# Altium project Vapeix_mini.PrjPcb
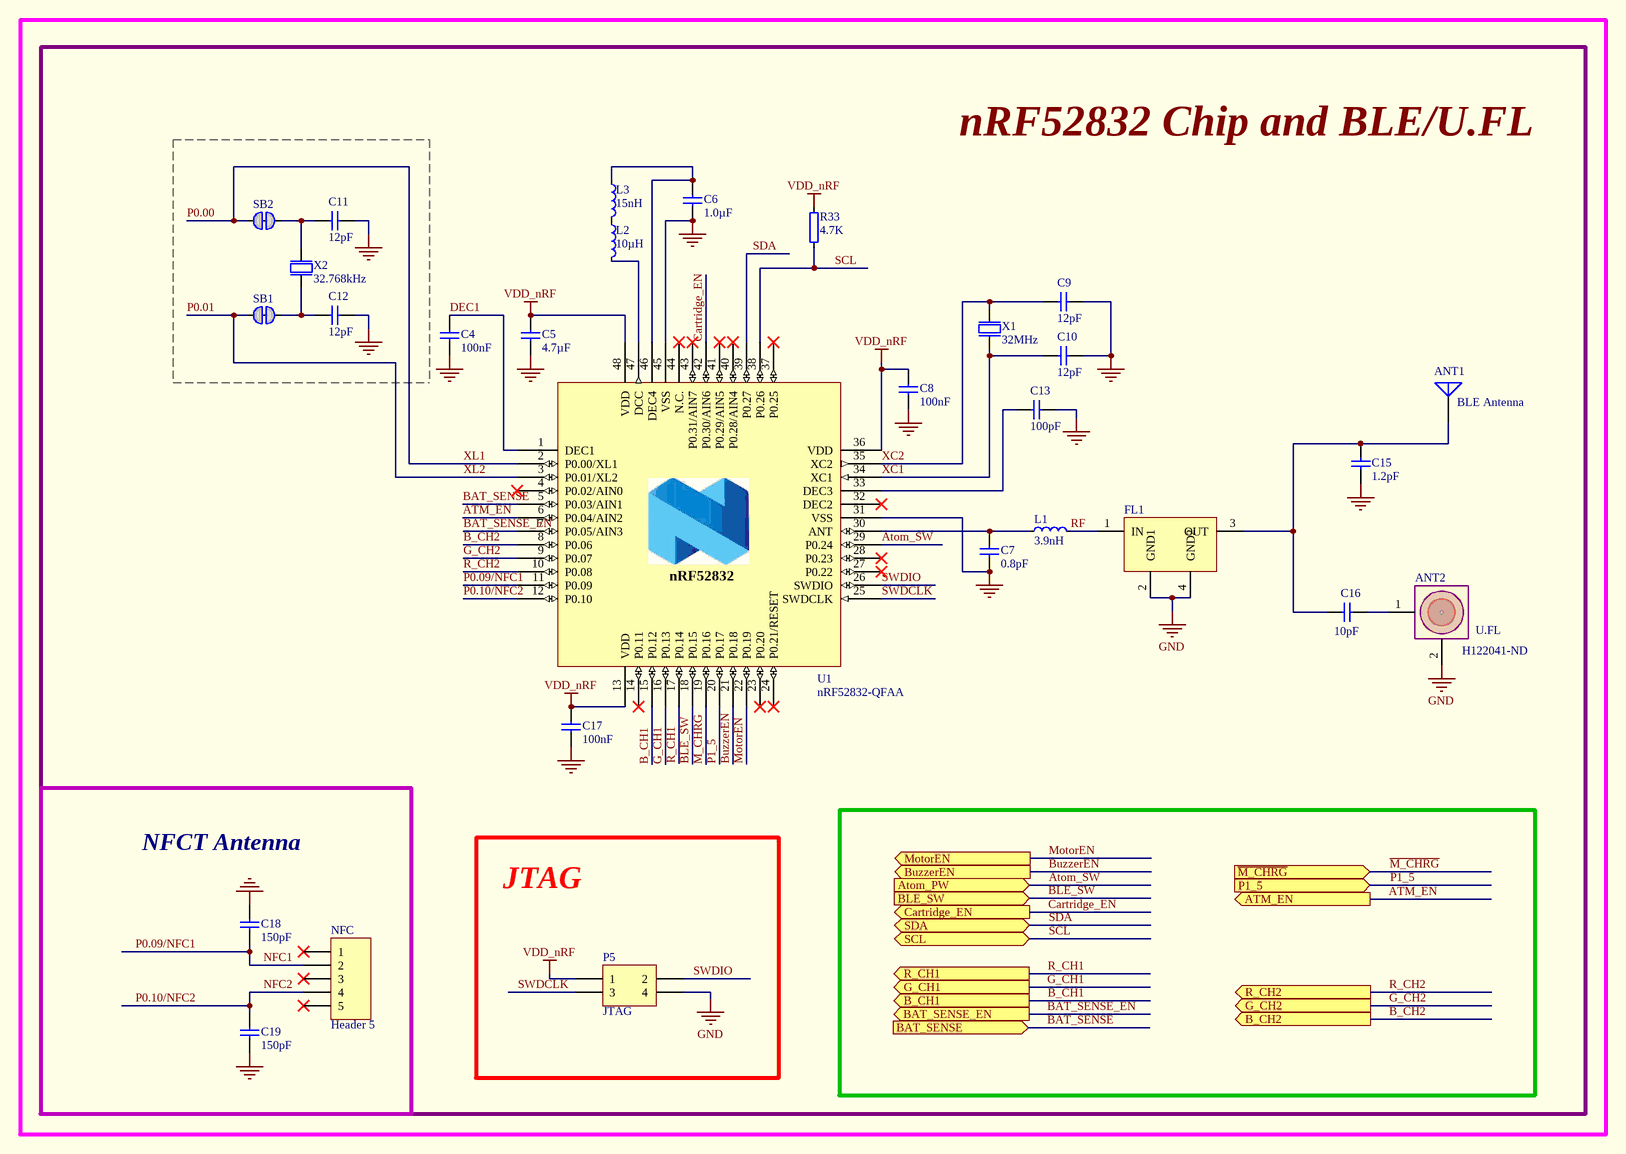
[diagram p0: Vapeix_mini_nrf.SchDoc]
3 sheets, 126 parts. Net scope: flat (ports and power ports of the same name join across sheets).
Board file: Vapeix_mini_pcb.PcbDoc
Sheets:
  Vapeix_mini_nrf.SchDoc
  Vapeix_mini_power.SchDoc
  Vapeix_mini_Shield.SchDoc

## Sheet Vapeix_mini_nrf.SchDoc: Vapeix Mini PCB - nRF Radio
size A3; DrawnBy: Rock Jon; Organization: Altium Limited; Address1: L3, 12a Rodborough Rd; Address2: Frenchs Forest; Address3: NSW; Address4: Australia 2086; DocumentNumber: 1; Revision: v1.0; SheetNumber: 1; SheetTotal: 1

### Parts
ANT1  BLE Antenna  [ANT_2450AT18A100]
ANT2  U.FL  Supplier Part Number 1: H122041-ND  [UFL-R-SMT]
C4  100nF  [C0201]
C5  4.7µF  [C0201]
C6  1.0µF  [C0201]
C7  0.8pF  [C0201]
C8  100nF  [C0201]
C9  12pF  [C0201]
C10  12pF  [C0201]
C11  12pF  [C0201]
C12  12pF  [C0201]
C13  100pF  [C0201]
C15  1.2pF  [C0201]
C16  10pF  [C0201]
C17  100nF  [C0201]
C18  150pF  [C0201]
C19  150pF  [C0201]
FL1  DEA202450BT-1294C1-H  [DEA202450BT-1294C1-H]  (value not drawn)
L1  3.9nH  [C0201]
L2  10µH  [INDC1608X06L]
L3  15nH  [C0201]
NFC  Header 5  [Molex 051281-0594]
P5  JTAG  [CON4]
R33  4.7K  [R0201]
SB1  Solderbridge  [Solderbridge_Shorted]  (value not drawn)  (net tie, no BOM)
SB2  Solderbridge  [Solderbridge_Shorted]  (value not drawn)  (net tie, no BOM)
U1  nRF52832-QFAA  [QFN40P600X600X90-48N]
X1  32MHz  [BT-XTAL_2016]
X2  32.768kHz  [XTAL_3215]

### Blocks framed on the sheet
NFCT Antenna: C18 C19 NFC

### Ports
ATM_EN (out), Atom_PW (in), B_CH1 (out), B_CH2 (out), BAT_SENSE (in), BAT_SENSE_EN (out), BLE_SW (in), BuzzerEN (out), Cartridge_EN (out), G_CH1 (out), G_CH2 (out), MotorEN (out), P1_5 (in), R_CH1 (out), R_CH2 (out), SCL (bidir), SDA (bidir), ~{M_CHRG} (in)

### Nets
GND: ANT2.2(GND) C4.2 C5.2 C6.1 C7.1 C8.2 C9.2 C10.2 C11.1 C12.1 C13.2 C15.2 C17.2 C18.2 C19.1 FL1.2(GND1) FL1.4(GND2) P5.4 U1.31(VSS) U1.45(VSS) U1.49(GND) X1.2(GND) X1.4(GND)
VDD_nRF: C5.1 C8.1 C17.1 P5.1 R33.2 U1.13(VDD) U1.36(VDD) U1.48(VDD)
ATM_EN: U1.6(P0.04/AIN2) ; port ATM_EN
Atom_SW: U1.29(P0.24) ; port Atom_PW
B_CH1: U1.15(P0.12) ; port B_CH1
B_CH2: U1.8(P0.06) ; port B_CH2
BAT_SENSE: U1.5(P0.03/AIN1) ; port BAT_SENSE
BAT_SENSE_EN: U1.7(P0.05/AIN3) ; port BAT_SENSE_EN
BLE_SW: U1.18(P0.15) ; port BLE_SW
BuzzerEN: U1.21(P0.18) ; port BuzzerEN
Cartridge_EN: U1.42(P0.30/AIN6) ; port Cartridge_EN
DEC1: C4.1 U1.1(DEC1)
G_CH1: U1.16(P0.13) ; port G_CH1
G_CH2: U1.9(P0.07) ; port G_CH2
~{M_CHRG}: U1.19(P0.16) ; port ~{M_CHRG}
MotorEN: U1.22(P0.19) ; port MotorEN
NFC1: C18.1 NFC.2 U1.11(P0.09)  [also labelled P0.09/NFC1]
NFC2: C19.2 NFC.4 U1.12(P0.10)  [also labelled P0.10/NFC2]
P0.00: SB2.2 U1.2(P0.00/XL1)  [also labelled XL1]
P0.01: SB1.2 U1.3(P0.01/XL2)  [also labelled XL2]
P1_5: U1.20(P0.17) ; port P1_5
R_CH1: U1.17(P0.14) ; port R_CH1
R_CH2: U1.10(P0.08) ; port R_CH2
RF: FL1.1(IN) L1.2
SCL: R33.1 U1.38(P0.26) ; port SCL
SDA: U1.39(P0.27) ; port SDA
SWDCLK: P5.3 U1.25(SWDCLK)
SWDIO: P5.2 U1.26(SWDIO)
XC1: C10.1 U1.34(XC1) X1.1(inp)
XC2: C9.1 U1.35(XC2) X1.3(out)
NetANT1_1: ANT1.1(A) C15.1 C16.1 FL1.3(OUT)
NetANT2_1: ANT2.1(SIG) C16.2
NetC6_2: C6.2 L3.1 U1.46(DEC4)
NetC7_2: C7.2 L1.1 U1.30(ANT)
NetC11_2: C11.2 SB2.1 X2.1(inp)
NetC12_2: C12.2 SB1.1 X2.2(out)
NetC13_1: C13.1 U1.33(DEC3)
NetL2_1: L2.1 L3.2
NetL2_2: L2.2 U1.47(DCC)

Not connected (* = marked no-connect by the designer): NFC 1* 3* 5*; U1 4(P0.02/AIN0)* 14(P0.11)* 23(P0.20)* 24(P0.21/RESET)* 27(P0.22)* 28(P0.23)* 32(DEC2)* 37(P0.25)* 40(P0.28/AIN4)* 41(P0.29/AIN5)* 43(P0.31/AIN7)* 44(N.C.)*

### Notes on the sheet
- Labels drawn without touching a wire or pin: JTAG, nRF52832 Chip and BLE/U.FL
- Title
- Size:
- Date:
- A4
- Number:
- Time:
- Revision:
- Sheet
- of
- Drawn by:
- File:
- (in symbol nRF52832-QFAA) nRF52832

### Library data of the parts
ANT1 = Antenna: Generic Antenna; Published: 24-Mar-1999; LatestRevisionDate: 17-Jul-2002; LatestRevisionNote: Re-released for DXP Platform.; PackageReference: PIN1; Publisher: Altium Limited
ANT2 = U.FL-R-SMT-1(01): CONN UMC JACK STR 50 OHM SMD; Manufacturer: Hirose Electric Co Ltd; Connector Style: U.FL, Ultra Miniature Coaxial; Connector Type: Jack, Male Pin; Contact Termination: Solder; Impedance: 50 Ohm; Frequency - Max: 6GHz; Body Material: Phosphor Bronze; Body Finish: Silver; Center Contact Plating: Gold; Dielectric Material: Liquid Crystal Polymer (LCP); Supplier 1: Digi-Key; Manufacturer Part Number: U.FL-R-SMT-1(01); RoHS: RoHS Compliant; Category: Connectors, Interconnects; Stock 1: 2248; Pricing 1: 1=1.28, 10=1.122, 25=1.056, 50=1.012, 100=0.968, 250=0.88, 500=0.792, 1000=0.704, 2500=0.638 (USD); Packaging: Bulk; Shield Termination: Solder; Mounting Type: Surface Mount; Cable Group: -; Fastening Type: Snap-On; Features: -; Housing Color: Silver; Ingress Protection: -; Center Contact Material: Phosphor Bronze; Voltage Rating: -; Operating Temperature: -40°C ~ 90°C; ComponentLink1URL: http://media.digikey.com/pdf/Data%20Sheets/Hirose%20PDFs/UFL%20Series.pdf; ComponentLink1Description: http://media.digikey.com/pdf/Data%20Sheets/Hirose%20PDFs/UFL%20Series.pdf
C4 C8 C17 = C0402-100n: Capacitor, X7R, ±10%; Note: 16V; Artikkelnr Noca: 20039200; Artikkelnr Simpro: N.A.; Part Number: C0402-100n; Manufacturer: *; Manufacturer Part Number: *; Datasheet: *; LatestRevisionDate: 2009-11-23; Pin Count: 2; Publisher: Nordic Semiconductor; Published: 2009-05-08; Value: 100nF; Supplier: *; Supplier part number: *; 2nd source Supplier: *; 2nd source part number: *; Footprint Doc: 0402
C5 = C0603-4µ7: Capacitor, X5R, ±10%; Note: 6.3V; Artikkelnr Noca: 20069060; Artikkelnr Simpro: N.A.; Part Number: C0603-4µ7; Manufacturer: *; Manufacturer Part Number: *; Datasheet: *; LatestRevisionDate: 2009-11-23; Pin Count: 2; Publisher: Nordic Semiconductor; Published: 2009-05-08; Value: 4.7µF; Supplier: *; Supplier part number: *; 2nd source Supplier: *; 2nd source part number: *; Footprint Doc: 0603
C6 = C0603-1µ0: Capacitor, X7R, ±10%; Note: 16V; Artikkelnr Noca: 20039335; Artikkelnr Simpro: N.A.; Part Number: C0603-1µ0; Manufacturer: *; Manufacturer Part Number: *; Datasheet: *; LatestRevisionDate: 2013-06-05; Pin Count: 2; Publisher: Nordic Semiconductor; Published: 2009-05-08; Value: 1.0µF; Supplier: *; Supplier part number: *; 2nd source Supplier: *; 2nd source part number: *; Footprint Doc: 0603
C7 = C0402-0.8p: Capacitor, NP0, ±5%; Note: 50V; Artikkelnr Noca: 20029147; Artikkelnr Simpro: N.A.; Part Number: C0402-0.8p; Manufacturer: *; Manufacturer Part Number: *; Datasheet: *; LatestRevisionDate: 2012-11-21; Pin Count: 2; Publisher: Nordic Semiconductor; Published: 2009-05-08; Value: 0.8pF; Supplier: *; Supplier part number: *; 2nd source Supplier: *; 2nd source part number: *; Footprint Doc: 0402
C9-C12 = C0402-12p: Capacitor, NP0, ±2%; Note: 50V; Artikkelnr Noca: 20029159; Artikkelnr Simpro: N.A.; Part Number: C0402-12p; Manufacturer: *; Manufacturer Part Number: *; Datasheet: *; LatestRevisionDate: 2011-05-11; Pin Count: 2; Publisher: Nordic Semiconductor; Published: 2009-05-08; Value: 12pF; Supplier: *; Supplier part number: *; 2nd source Supplier: *; 2nd source part number: *; Footprint Doc: 0402
C13 = C0402-100p: Capacitor, NP0, ±5%; Note: 50V; Artikkelnr Noca: 20029135; Artikkelnr Simpro: N.A.; Part Number: C0402-100p; Manufacturer: *; Manufacturer Part Number: *; Datasheet: *; LatestRevisionDate: 2009-05-08; Pin Count: 2; Publisher: Nordic Semiconductor; Published: 2009-05-08; Value: 100pF; Supplier: *; Supplier part number: *; 2nd source Supplier: *; 2nd source part number: *; Footprint Doc: 0402
C15 = C0402-1.2p: Capacitor, NP0, ±0.1pF; Note: 50V; Artikkelnr Noca: 20029157; Artikkelnr Simpro: N.A.; Part Number: C0402-1.2p; Manufacturer: *; Manufacturer Part Number: *; Datasheet: *; LatestRevisionDate: 2011-05-11; Pin Count: 2; Publisher: Nordic Semiconductor; Published: 2009-05-08; Value: 1.2pF; Supplier: *; Supplier part number: *; 2nd source Supplier: *; 2nd source part number: *; Footprint Doc: 0402
C16 = C0402-N.C.: Not mounted; Note: Chip Cap; Artikkelnr Noca: N.A.; Part Number: C0402-N.C.; Manufacturer: *; Manufacturer Part Number: *; Datasheet: *; LatestRevisionDate: 2009-05-08; Pin Count: 2; Publisher: Nordic Semiconductor; Published: 2009-05-08; Value: 10pF; Supplier: *; Supplier part number: *; 2nd source Supplier: *; 2nd source part number: *; Footprint Doc: 0402; Artikkelnr Simpro: N.A.
C18 C19 = C0402-300p: Capacitor, NP0, ±5%; Note: 50V; Artikkelnr Noca: N.A.; Part Number: C0402-300p; Manufacturer: *; Manufacturer Part Number: *; Datasheet: *; Footprint Doc: 0402; LatestRevisionDate: 2015-05-29; Pin Count: 2; Publisher: Nordic Semiconductor; Published: 2015-05-29; Value: 150pF; Supplier: Digi-Key; Supplier part number: 490-3234-1-ND; 2nd source Supplier: *; 2nd source part number: *; Artikkelnr Simpro: N.A.
FL1 = DEA202450BT-1294C1-H (2): FILTER BANDPASS WLAN&BLUETOOTH; Manufacturer: TDK Corporation; Supplier 1: Digi-Key; Manufacturer Part Number: DEA202450BT-1294C1-H; RoHS: RoHS Compliant; Category: Filters; Stock 1: 14479; Pricing 1: 1=0.51, 10=0.477, 100=0.4252, 250=0.40324, 500=0.33724, 1000=0.26173 (USD); ComponentLink1URL: https://product.tdk.com/info/en/documents/data_sheet/rf_bpf_dea202450bt-1294c1-h_en.pdf; ComponentLink1Description: https://product.tdk.com/info/en/documents/data_sheet/rf_bpf_dea202450bt-1294c1-h_en.pdf; Supplier Part Number 1: 445-172335-1-ND
L1 = L0402-3n9: Inductor, 170mA, ±0.1nH; Manufacturer: Murata; Manufacturer Part Number: LQP15MN3N9B02D; Note: High frequency chip inductor ±5%; Artikkelnr Noca: 33029151; Artikkelnr Simpro: N.A.; Part Number: L0402-3n9; Datasheet: http://search.murata.co.jp/Ceramy/image/img/PDF/ENG/L0075S0084LQP15M.pdf; LatestRevisionDate: 2012-09-19; Pin Count: 2; Publisher: Nordic Semiconductor; Published: 2009-05-08; Value: 3.9nH; Supplier: Digi-Key; Supplier part number: 490-1131-1-ND; 2nd source Supplier: *; 2nd source part number: *; Footprint Doc: 0402
L2 = L0603-10µ: Inductor, 80mA, ±10%; Manufacturer: Taiyo Yuden; Manufacturer Part Number: LBMF1608T100K; 2nd source part number: 178-6105; Note: LBMF1608T100K 10µH 80mA 0603; Artikkelnr Noca: 33029314; Artikkelnr Simpro: N.A.; Part Number: L0603-10µ; Datasheet: http://www.yuden.co.jp/ut/product/pdf/elb2_e.pdf; LatestRevisionDate: 2012-09-19; Pin Count: 2; Publisher: Nordic Semiconductor; Published: 2010-02-24; Value: 10µH; Supplier: Digi-Key; Supplier part number: 587-1714-1-ND; 2nd source Supplier: Farnell; Footprint Doc: 0603
L3 = L0402-15n: Inductor, 320mA, ±5%; Manufacturer: Taiyo Yuden; Manufacturer Part Number: HK100515NJ-T; 2nd source part number: 658-1328; Note: High frequency chip inductor ±10%; Artikkelnr Noca: 33029323; Artikkelnr Simpro: N.A.; Part Number: L0402-15n; LatestRevisionDate: 2012-09-19; Pin Count: 2; Publisher: Nordic Semiconductor; Published: 2010-07-12; Value: 15nH; Supplier: Digi-Key; Datasheet: http://www.yuden.co.jp/productdata/catalog/en/mlci04_e.pdf; Supplier part number: 587-1521-1-ND; 2nd source Supplier: Farnell; Footprint Doc: 0402
NFC = Header 5: Header, 5-Pin; LatestRevisionDate: 17-Jul-2002; LatestRevisionNote: Re-released for DXP Platform.; Publisher: Altium Limited
P5 = Header 2X2: Header, 2-Pin, Dual row; LatestRevisionDate: 17-Jul-2002; LatestRevisionNote: Re-released for DXP Platform.; Publisher: Altium Limited
R33 = R0402-10k: Resistor, ±1%, 0.063W; Note: Chip Res 1%; Artikkelnr Noca: 27049097; Artikkelnr Simpro: N.A.; Part Number: R0402-10k; Manufacturer: *; Manufacturer Part Number: *; Datasheet: *; Footprint Doc: 0402; LatestRevisionDate: 2009-11-23; Pin Count: 2; Publisher: Nordic Semiconductor; Published: 2009-05-08; Value: 4.7K; Supplier: Farnell; Supplier part number: 173-8864; 2nd source Supplier: *; 2nd source part number: *
SB1 SB2 = Solderbridge Shorted: Shorted Solderbridge; Artikkelnr Noca: N.A.; Part Number: Solderbridge Shorted; Manufacturer: *; Manufacturer Part Number: *; Datasheet: *; LatestRevisionDate: 2012-08-07; Pin Count: 2; Publisher: Nordic Semiconductor; Published: 2012-08-07; Value: Solderbridge; Note: *; Supplier: *; Supplier part number: *; 2nd source Supplier: *; 2nd source part number: *; Footprint Doc: Solderbridge_Shorted; Artikkelnr Simpro: N.A.
U1 = nRF52832-QFAA: Multi-protocol Bluetooth Low Energy and 2.4GHz proprietary system-on-chip; Manufacturer: Nordic Semiconductor; Artikkelnr Noca: N.A.; Part Number: nRF52832-QFAA; Manufacturer Part Number: nRF52832-QFAA; Datasheet: *; LatestRevisionDate: 2014-11-26; Pin Count: 48; Publisher: Nordic Semiconductor; Published: 2014-11-26; Value: nRF52832-QFAA; Note: *; Supplier: Nordic Semiconductor; Supplier part number: *; 2nd source Supplier: *; 2nd source part number: *; Footprint Doc: QFN-48; Artikkelnr Simpro: N.A.
X1 = XTAL_SMD2016_32MHz_8pF_Epson: XTAL SMD 2016, 32MHz, Cl=8pF, Tol: ±10ppm, Stab: ±10ppm; Manufacturer: Epson Toyocom; Manufacturer Part Number: Q22FA12800025; Note: XTAL SMD 32.000MHz; Artikkelnr Noca: N.A.; Part Number: XTAL_SMD2016_32MHz_8pF_Epson; Datasheet: http://www.epsondevice.com/docs/qd/en/DownloadServlet?id=ID000449; LatestRevisionDate: 2014-11-27; Pin Count: 4; Publisher: Nordic Semiconductor; Published: 2012-03-09; Value: 32MHz; Supplier: Farnell; Supplier part number: 171-2806; 2nd source Supplier: *; 2nd source part number: *; Footprint Doc: XTAL_2016; Artikkelnr Simpro: N.A.
X2 = XTAL_FC-135 32.768k: EPSON TOYOCOM - FC-135 32.768KHZ ±20PPM,9.0PF - CRYSTAL, SM, WATCH; 2nd source part number: 127-8037; Note: XTAL SMD 32.768kHz, 3215; Artikkelnr Noca: 22019091; Artikkelnr Simpro: N.A.; Part Number: XTAL_FC-135 32.768k; Manufacturer: Epson Toyocom; Manufacturer Part Number: FC-135 32.768KHZ ±20PPM,9.0PF; Datasheet: http://www.farnell.com/datasheets/57480.pdf; LatestRevisionDate: 2014-03-27; Pin Count: 2; Publisher: Nordic Semiconductor; Published: 2010-10-18; Value: 32.768kHz; Supplier: Digi-Key; Supplier part number: FC-135 32.7680KA-AC-ND; 2nd source Supplier: Farnell; Footprint Doc: XTAL_3215

## Sheet Vapeix_mini_power.SchDoc: Vapeix Mini PCB - Power Supply
size A3; DrawnBy: Rock Jon; Organization: Altium Limited; Address1: L3, 12a Rodborough Rd; Address2: Frenchs Forest; Address3: NSW; Address4: Australia 2086; Revision: v1.0
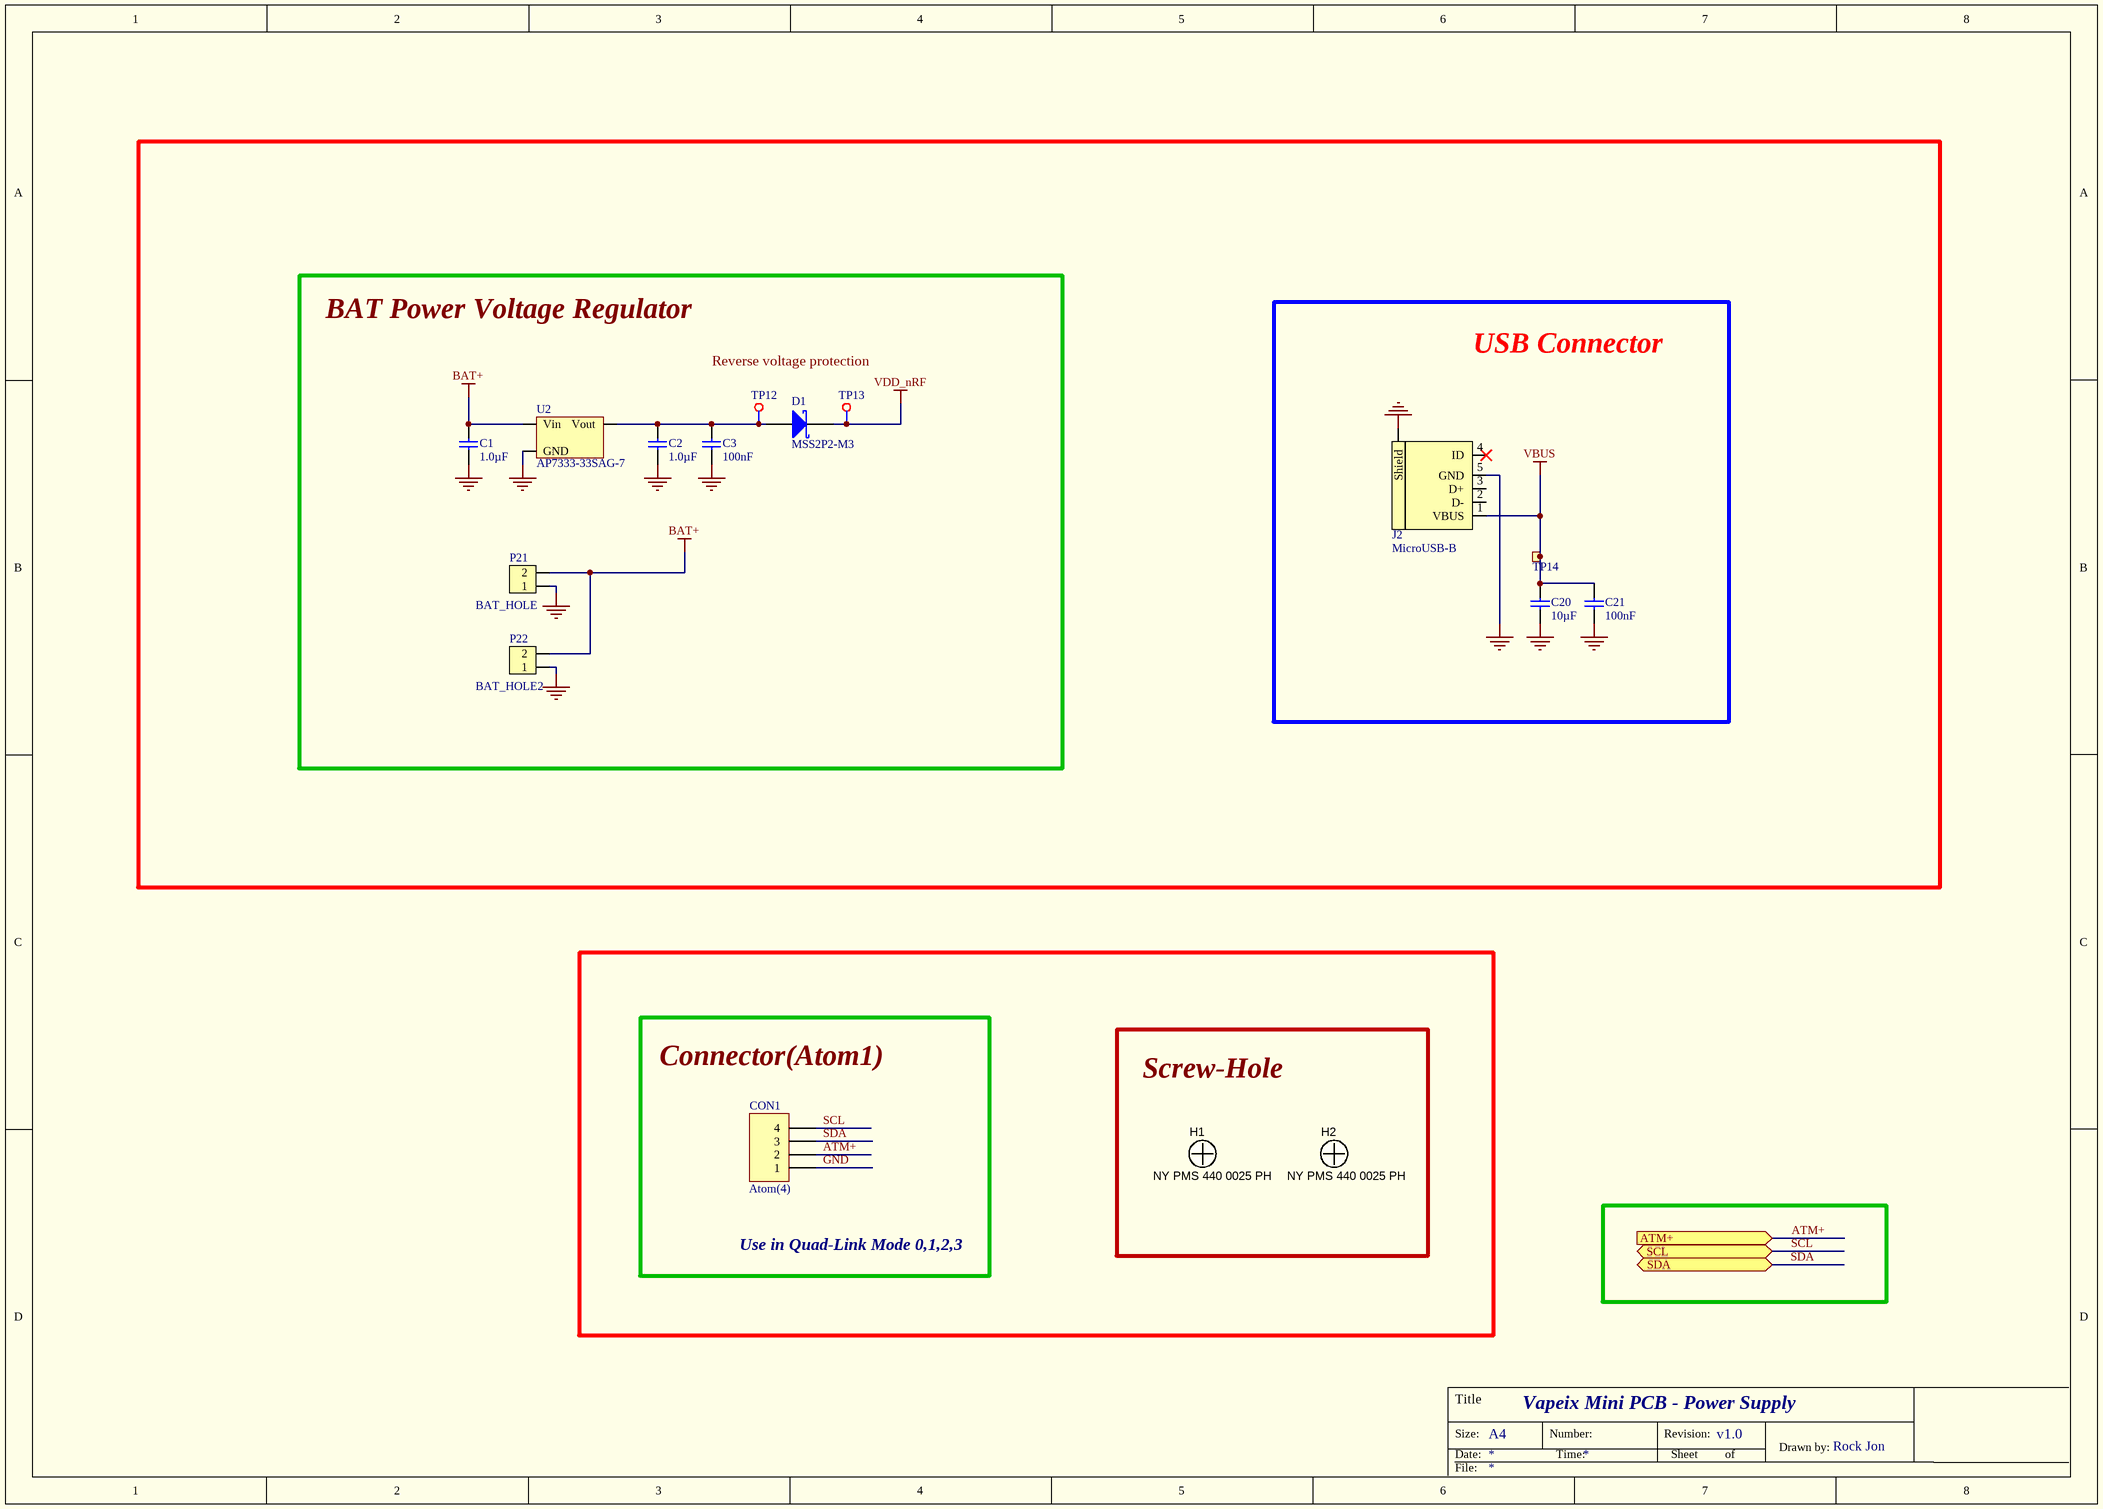
[diagram p1: Vapeix_mini_power.SchDoc]

### Parts
C1  1.0µF  [C0201]
C2  1.0µF  [C0201]
C3  100nF  [C0201]
C20  10µF  [C0201]
C21  100nF  [C0201]
CON1  Atom(4)  [S4B-PH-K-S]
D1  MSS2P2-M3  [MSS2P2-M3]
H1  NY PMS 440 0025 PH  [SCREW_HOLE2]
H2  NY PMS 440 0025 PH  [SCREW_HOLE2]
J2  MicroUSB-B  [FCI_10118193-0001LF]
P21  BAT_HOLE  [CON2]
P22  BAT_HOLE2  [CON2]
TP12  TP  [TP]  (value not drawn)
TP13  TP  [TP]  (value not drawn)
TP14  Ø1.0mm,SMD  [TP_SMD_Ø1.0mm]  (value not drawn)  (no BOM)
U2  AP7333-33SAG-7  [SOT-23A]

### Blocks framed on the sheet
Reverse voltage protection: C1-C3 D1 P21 P22 TP12 TP13 U2

### Ports
ATM+ (in), SCL (bidir), SDA (bidir)

### Nets
BAT+: C1.2 P21.2 P22.2 U2.1(Vin)
GND: C1.1 C2.1 C3.1 C20.1 C21.1 CON1.1 J2.5(GND) J2.6(Shield) P21.1 P22.1 U2.3(GND)
VBUS: C20.2 C21.2 J2.1(VBUS) TP14.1
VDD_nRF: D1.2(K) TP13.1(TP)
ATM+: CON1.2 ; port ATM+
SCL: CON1.4 ; port SCL
SDA: CON1.3 ; port SDA
NetC2_2: C2.2 C3.2 D1.1(A) TP12.1(TP) U2.2(Vout)

Not connected (* = marked no-connect by the designer): J2 2(D-) 3(D+) 4(ID)*

### Notes on the sheet
- Labels drawn without touching a wire or pin: BAT Power Voltage Regulator, Connector(Atom1), Screw-Hole, USB Connector, Use in Quad-Link Mode 0,1,2,3
- Title
- Size:
- Date:
- A4
- Number:
- Time:
- Revision:
- Sheet
- of
- Drawn by:
- File:

### Library data of the parts
C1 C2 = C0603-1µ0: as C6 on sheet Vapeix_mini_nrf; Published: 2009-05-08; LatestRevisionDate: 2013-06-05; Publisher: Nordic Semiconductor; Value: 1.0µF; Part Number: C0603-1µ0; Manufacturer: *; Manufacturer Part Number: *; Datasheet: *; Pin Count: 2; Supplier: *; Supplier part number: *; 2nd source Supplier: *; 2nd source part number: *; Footprint Doc: 0603
C3 C21 = C0402-100n: as C4 on sheet Vapeix_mini_nrf; Published: 2009-05-08; LatestRevisionDate: 2009-11-23; Publisher: Nordic Semiconductor; Value: 100nF; Part Number: C0402-100n; Manufacturer: *; Manufacturer Part Number: *; Datasheet: *; Pin Count: 2; Supplier: *; Supplier part number: *; 2nd source Supplier: *; 2nd source part number: *; Footprint Doc: 0402
C20 = C0603-10µ: Capacitor, X5R, ±20%; Note: 6.3V; Artikkelnr Noca: 20039234; Artikkelnr Simpro: N.A.; Part Number: C0603-10µ; Manufacturer: *; Manufacturer Part Number: *; Datasheet: *; LatestRevisionDate: 2011-01-17; Pin Count: 2; Publisher: Nordic Semiconductor; Published: 2011-01-17; Value: 10µF; Supplier: *; Supplier part number: *; 2nd source Supplier: *; 2nd source part number: *; Footprint Doc: 0603
CON1 = S4B-PH-K-S(LF)(SN): CONN HEADER PH SIDE 4POS 2MM; Manufacturer: JST Sales America Inc.; Connector Type: Header, Shrouded; Number of Positions: 4; Number of Positions Loaded: All; Pitch: 0.079" (2.00mm); Supplier 1: Digi-Key; Manufacturer Part Number: S4B-PH-K-S(LF)(SN); RoHS: RoHS Compliant; Category: Connectors, Interconnects; Stock 1: 41576; Pricing 1: 1=0.22, 10=0.208, 25=0.1772, 50=0.155, 100=0.144, 250=0.1274, 500=0.12186, 1000=0.0997, 2500=0.09139 (USD); Packaging: Bulk; Contact Type: Male Pin; Number of Rows: 1; Row Spacing: -; Contact Mating Length: 0.130" (3.30mm); Mounting Type: Through Hole, Right Angle; Termination: Press-Fit, Solder; Fastening Type: Detent Lock; Features: -; Contact Finish: Tin; Contact Finish Thickness: -; Color: Natural; ComponentLink1URL: http://www.jst-mfg.com/product/pdf/eng/ePH.pdf; ComponentLink1Description: http://www.jst-mfg.com/product/pdf/eng/ePH.pdf
D1 = MSS2P2-M3/89A: DIODE SCHOTTKY 20V 2A MICROSMP; Manufacturer: Vishay Semiconductor Diodes Division; Voltage - Forward (Vf) (Max) @ If: 600mV @ 2A; Speed: Fast Recovery =< 500ns, > 200mA (Io); Current - Reverse Leakage @ Vr: 250µA @ 20V; Capacitance @ Vr, F: 65pF @ 4V, 1MHz; Supplier 1: Digi-Key; Manufacturer Part Number: MSS2P2-M3/89A; RoHS: RoHS Compliant; Category: Discrete Semiconductor Products; Stock 1: 3961; Pricing 1: 1=0.37, 10=0.274, 100=0.1552, 500=0.1029, 1000=0.07892 (USD); Packaging: Digi-Reel®; Diode Type: Schottky; Voltage - DC Reverse (Vr) (Max): 20V; Current - Average Rectified (Io): 2A; Reverse Recovery Time (trr): -; Mounting Type: Surface Mount; Package / Case: MicroSMP; Supplier Device Package: MicroSMP; Operating Temperature - Junction: -55°C ~ 150°C; ComponentLink1URL: http://www.vishay.com/docs/89054/mss2p3.pdf; ComponentLink1Description: http://www.vishay.com/docs/89054/mss2p3.pdf
H1 H2 = Screw-Hole: Machine Screw, Round, #4-40 x 1/4, Nylon, Philips panhead; Manufacturer: B&F Fastener Supply; Manufacturer Part Number: CP2102-GM; CompType: Hardware; SymbolCreator: codlsc; U/M: EA; USB Type: USB UART; USB Standard: USB 2.0; Supply Voltage Min: 3; Supply Voltage Max: 3.6; Interface Case Style: QFN; No. of Pins: 28; Data Rate: 1; No. of Ports: 1 Port; Base Number: 2102; Bridge Type: USB to UART; Supply Voltage Range: 3V to 5.25V<!--FANDB--><div class="features-and-benefits-container"><div class="features-and-benefits-desc-container"><span class="features-and-benefits-container-desc">USB to UART Bridge Controller in QFN-28 Package</span></div><div class="features-and-benefits-description"><span class="features-benefits-value">The CP2102-GM is a highly integrated USB to UART Bridge Controller providing a simple solution for updating RS-232 designs to USB using a minimum of components and PCB space. The CP2102-GM includes a USB 2.0 full speed function controller, USB transceiver, oscillator, EEPROM, and asynchronous serial data bus (UART) with full modem control signals. No other external USB components are required. The on chip EEPROM may be used to customise the USB Vendor ID, Product ID, Product Description String, Power Descriptor, Device Release Number, and Device Serial Number as desired for OEM applications. The EEPROM is programmed on board via the USB, allowing the programming step to be easily integrated into the product manufacturing and testing process.</span></div><div class="features-and-benefits-list"><ul class="features-and-benefits-list-list"><li class="features-and-benefits-list-item">Integrated USB transceiver; no external crystal required</li><li class="features-and-benefits-list-item">Integrated 1024 Byte EEPROM</li><li class="features-and-benefits-list-item">On chip power on reset circuit</li><li class="features-and-benefits-list-item">On chip voltage regulator: 3.3V output</li><li class="features-and-benefits-list-item">USB Specification 2.0 compliant; full-speed (12 Mbps)</li><li class="features-and-benefits-list-item">USB suspend states supported via SUSPEND pins</li><li class="features-and-benefits-list-item">All handshaking and modem interface signals</li><li class="features-and-benefits-list-item">Baud rates: 300 bps to 1 Mbits</li><li class="features-and-benefits-list-item">576 Byte receive buffer; SymbolVersion: 2009-10-28; MountType: N/A; RoHS: Y; PartNumber: NY PMS 440 0025 PH; PackageReference: Screw; DigiKeyPartNumber: H542-ND; ComponentLink1Description: Datasheet Link; ComponentLink1URL: http://www.fasnetdirect.com/refguide/Machinepancombo.pdf; ClassName: Mounting Holes; LatestRevisionDate: 2014-05-15; Publisher: Texas Instruments; Supplier 1: Digi-Key; Supplier Part Number 1: H542-ND; Supplier 4: Farnell; Stock 4: 9194; Pricing 4: 1=1.82, 10=1.72, 100=1.69, 250=1.66, 500=1.62, 2000=1.59, 3000=1.56, 5000=1.55 (GBP); Operating Temperature Min: -40; Operating Temperature Max: 85; Packaging: Each; MSL: -; Logic Function Number: 2102; Operating Temperature Range: -40°C to +85; ComponentLink2URL: http://www.farnell.com/datasheets/1694195.pdf; ComponentLink2Description: http://www.farnell.com/datasheets/1694195.pdf; Supplier Part Number 4: 9282130
J2 = FCI 10118193-0001LF: MicroUSB-B-SMT; Manufacturer: FCI; 2nd source part number: 649-10118193-0001LF; Artikkelnr Noca: N.A.; Part Number: FCI 10118193-0001LF; Manufacturer Part Number: 10118193-0001LF; Datasheet: http://portal.fciconnect.com/Comergent//fci/drawing/10118193.pdf; Footprint Doc: FCI_10118193-0001LF; LatestRevisionDate: 2014-10-07; Pin Count: 5; Publisher: Nordic Semiconductor; Published: 2014-10-07; Value: MicroUSB-B; Note: *; Supplier: Digi-Key; Supplier part number: 609-4616-1-ND; 2nd source Supplier: Mouser; Artikkelnr Simpro: N.A.
P21 P22 = Pin List Ang 1x2 SMD, 2.54mm: Pin List 1x2, 2.54mm (100mil), Right Angled, SMD; 2nd source part number: S1113E-02-ND; Artikkelnr Noca: N.A.; Part Number: Pin List Ang 1x2 SMD, 2.54mm; Manufacturer: *; Manufacturer Part Number: *; Datasheet: *; LatestRevisionDate: 2014-04-30; Pin Count: 2; Publisher: Nordic Semiconductor; Published: 2014-04-30; Note: *; Supplier: Samtec; Supplier part number: TSM-102-01-L-SH-A; 2nd source Supplier: Digi-Key; Footprint Doc: LIST_ANG_1x2-SMD-2.54MM; Artikkelnr Simpro: N.A.
  P21: Value: BAT_HOLE
  P22: Value: BAT_HOLE2
TP12 TP13 = TP: TEST POINT
TP14 = TP_SMD_Ø1.0MM: 1.0mm circular SMD testpad; Manufacturer: Nordic Semiconductor; Artikkelnr Noca: N.A.; Part Number: TP_SMD_Ø1.0MM; Manufacturer Part Number: *; Datasheet: *; LatestRevisionDate: 2013-06-11; Pin Count: 1; Publisher: Nordic Semiconductor; Published: 2013-06-11; Value: Ø1.0mm,SMD; Note: *; Supplier: *; Supplier part number: *; 2nd source Supplier: *; 2nd source part number: *; Footprint Doc: TP_SMD_Ø1.0mm; Artikkelnr Simpro: N.A.
U2 = AP7333-33SAG-7: 300mA, Low Quiescent Current, Fast Transient Low Dropout Linear Regulator; Manufacturer: Diodes Incorporated; Artikkelnr Noca: 17039216; Artikkelnr Simpro: N.A.; Part Number: AP7333-33SAG-7; Manufacturer Part Number: AP7333-33SAG-7; Datasheet: http://www.diodes.com/datasheets/AP7333.pdf; LatestRevisionDate: 2012-06-15; Pin Count: 3; Publisher: Nordic Semiconductor; Published: 2012-06-15; Value: AP7333-33SAG-7; Note: *; Supplier: Digi-Key; Supplier part number: AP7333-33SAG-7DICT-ND; 2nd source Supplier: *; 2nd source part number: *; Footprint Doc: SOT-23-3

## Sheet Vapeix_mini_Shield.SchDoc: Vapeix Mini PCB - Interface
size A3; DrawnBy: Rock Jon; Organization: Altium Limited; Address1: L3, 12a Rodborough Rd; Address2: Frenchs Forest; Address3: NSW; Address4: Australia 2086; Revision: v1.0
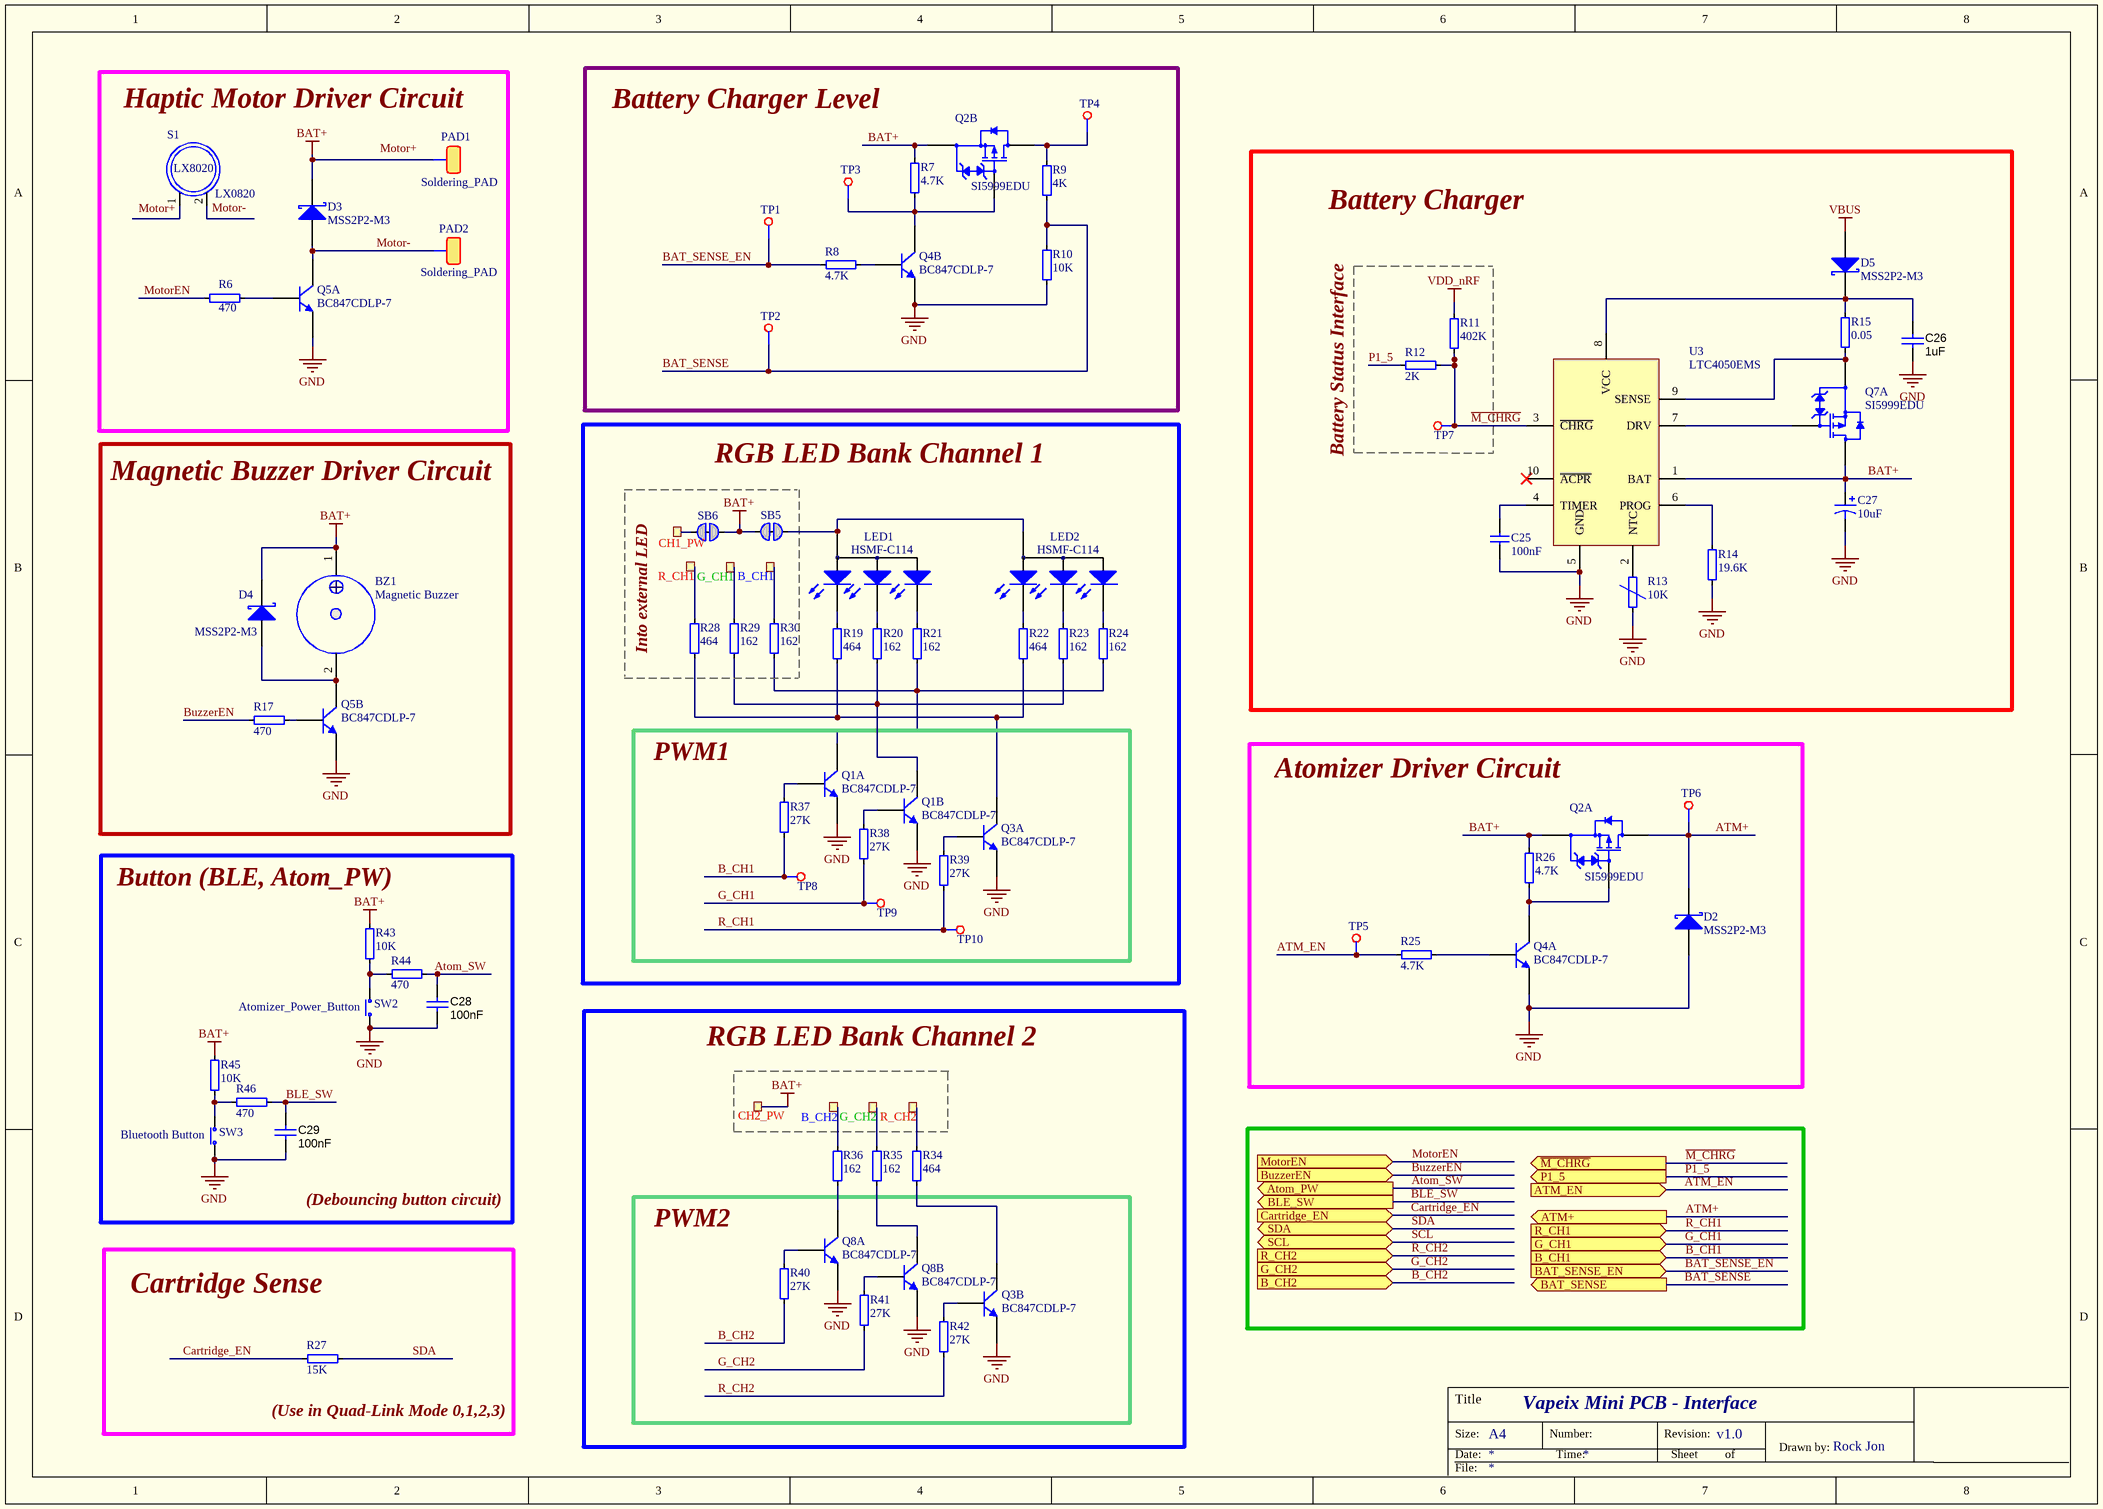
[diagram p2: Vapeix_mini_Shield.SchDoc]

### Parts
B_CH1  TP  [TESTPAD-TH]  (value not drawn)  (no BOM)
B_CH2  TP  [TESTPAD-TH]  (value not drawn)  (no BOM)
BZ1  Magnetic Buzzer  [Magnetic Buzzer]
C25  100nF  [C0201]
C26  ValueDisplayed: 1uF  [C0201]
C27  value 10uF  [CAPC1005X04L]  (hidden comment: Cap Pol3)
C28  ValueDisplayed: 100nF  [C0201]
C29  ValueDisplayed: 100nF  [C0201]
CH1_PW  TP  [TESTPAD-TH]  (value not drawn)  (no BOM)
CH2_PW  TP  [TESTPAD-TH]  (value not drawn)  (no BOM)
D2  MSS2P2-M3  [MSS2P2-M3]
D3  MSS2P2-M3  [MSS2P2-M3]
D4  MSS2P2-M3  [MSS2P2-M3]
D5  MSS2P2-M3  [MSS2P2-M3]
G_CH1  TP  [TESTPAD-TH]  (value not drawn)  (no BOM)
G_CH2  TP  [TESTPAD-TH]  (value not drawn)  (no BOM)
LED1  HSMF-C114  [HSMF-C114]
LED2  HSMF-C114  [HSMF-C114]
PAD1  Soldering_PAD  [Soldering_PAD]
PAD2  Soldering_PAD  [Soldering_PAD]
Q1  BC847CDLP-7  [BC847CDLP-7]  (parts A,B of 2)
Q2  SI5999EDU  [SI5999EDU]  (parts A,B of 2)
Q3  BC847CDLP-7  [BC847CDLP-7]  (parts A,B of 2)
Q4  BC847CDLP-7  [BC847CDLP-7]  (parts A,B of 2)
Q5  BC847CDLP-7  [BC847CDLP-7]  (parts A,B of 2)
Q7  SI5999EDU  [SI5999EDU]  (part A of 2)
Q8  BC847CDLP-7  [BC847CDLP-7]  (parts A,B of 2)
R6  470  [R0201]
R7  4.7K  [R0201]
R8  4.7K  [R0201]
R9  4K  [R0201]
R10  10K  [R0201]
R11  402K  [R0201]
R12  2K  [R0201]
R13  10K  [RL0503-5820-97-MS]
R14  19.6K  [R0201]
R15  0.05  [R0402]
R17  470  [RESC1005X04L]
R19  464  [R0201]
R20  162  [R0201]
R21  162  [R0201]
R22  464  [R0201]
R23  162  [R0201]
R24  162  [R0201]
R25  4.7K  [R0201]
R26  4.7K  [R0201]
R27  15K  [R0201]
R28  464  [R0201]
R29  162  [R0201]
R30  162  [R0201]
R34  464  [R0201]
R35  162  [R0201]
R36  162  [R0201]
R37  27K  [R0201]
R38  27K  [R0201]
R39  27K  [R0201]
R40  27K  [R0201]
R41  27K  [R0201]
R42  27K  [R0201]
R43  10K  [R0201]
R44  470  [R0201]
R45  10K  [R0201]
R46  470  [R0201]
R_CH1  TP  [TESTPAD-TH]  (value not drawn)  (no BOM)
R_CH2  TP  [TESTPAD-TH]  (value not drawn)  (no BOM)
S1  LX0820  [LX0820L20140926-01]
SB5  Solderbridge  [Solderbridge_Shorted]  (value not drawn)  (net tie, no BOM)
SB6  Solderbridge  [Solderbridge_Shorted]  (value not drawn)  (net tie, no BOM)
SW2  Atomizer_Power_Button  [ALPS_SKHUxxx010_WO_GND]
SW3  Bluetooth Button  [ALPS_SKHUxxx010_WO_GND]
TP1  TP  [TP]  (value not drawn)
TP2  TP  [TP]  (value not drawn)
TP3  TP  [TP]  (value not drawn)
TP4  TP  [TP]  (value not drawn)
TP5  TP  [TP]  (value not drawn)
TP6  TP  [TP]  (value not drawn)
TP7  TP  [TP]  (value not drawn)
TP8  TP  [TP]  (value not drawn)
TP9  TP  [TP]  (value not drawn)
TP10  TP  [TP]  (value not drawn)
U3  LTC4050EMS  [LTC4050EMS]

### Ports
ATM+ (out), ATM_EN (in), Atom_PW (out), B_CH1 (in), B_CH2 (in), BAT_SENSE (out), BAT_SENSE_EN (in), BLE_SW (out), BuzzerEN (in), Cartridge_EN (in), G_CH1 (in), G_CH2 (in), MotorEN (in), P1_5 (out), R_CH1 (in), R_CH2 (in), SCL (bidir), SDA (bidir), ~{M_CHRG} (out)

### Nets
BAT+: BZ1.1(P) C27.1 CH2_PW.1 D3.2(K) D4.2(K) PAD1.1(TP) Q2.1(S1) Q2.3(S2) Q7.7(D1) R7.1 R26.2 R43.2 R45.2 SB5.2 SB6.2 U3.1(BAT)
GND: C25.2 C26.2 C27.2 C28.2 C29.2 D2.1(A) Q1.1(E1) Q1.4(E2) Q3.1(E1) Q3.4(E2) Q4.1(E1) Q4.4(E2) Q5.1(E1) Q5.4(E2) Q8.1(E1) Q8.4(E2) R10.2 R13.2 R14.2 SW2.1(N.O) SW3.1(N.O) U3.5(GND)
VBUS: D5.1(A)
VDD_nRF: R11.1
ATM+: D2.2(K) Q2.7(D1) TP6.1(TP) ; port ATM+
ATM_EN: R25.1 TP5.1(TP) ; port ATM_EN
Atom_SW: C28.1 R44.1 ; port Atom_PW
B_CH1: R37.2 TP8.1(TP) ; port B_CH1
B_CH2: R40.2 ; port B_CH2
BAT_SENSE: R9.2 R10.1 TP2.1(TP) ; port BAT_SENSE
BAT_SENSE_EN: R8.2 TP1.1(TP) ; port BAT_SENSE_EN
BLE_SW: C29.1 R46.1 ; port BLE_SW
BuzzerEN: R17.2 ; port BuzzerEN
Cartridge_EN: R27.2 ; port Cartridge_EN
G_CH1: R38.2 TP9.1(TP) ; port G_CH1
G_CH2: R41.2 ; port G_CH2
~{M_CHRG}: R11.2 R12.2 TP7.1(TP) U3.3(~{CHRG}) ; port ~{M_CHRG}
Motor-: D3.1(A) PAD2.1(TP) Q5.3(C1)
MotorEN: R6.2 ; port MotorEN
P1_5: R12.1 ; port P1_5
R_CH1: R39.2 TP10.1(TP) ; port R_CH1
R_CH2: R42.1 ; port R_CH2
SDA: R27.1 ; port SDA
NetB_CH1_1: B_CH1.1 R30.1
NetB_CH2_1: B_CH2.1 R36.1
NetBZ1_2: BZ1.2(M) D4.1(A) Q5.6(C2)
NetC25_1: C25.1 U3.4(TIMER)
NetC26_1: C26.1 D5.2(K) R15.1 U3.8(VCC)
NetCH1_PW_1: CH1_PW.1 SB6.1
NetG_CH1_1: G_CH1.1 R29.1
NetG_CH2_1: G_CH2.1 R35.1
NetLED1_1: LED1.1(ANODE) LED2.1(ANODE) SB5.1
NetLED1_2: LED1.2(RED) R19.1
NetLED1_3: LED1.3(GREEN) R20.1
NetLED1_4: LED1.4(BLUE) R21.1
NetLED2_2: LED2.2(RED) R22.1
NetLED2_3: LED2.3(GREEN) R23.1
NetLED2_4: LED2.4(BLUE) R24.1
NetQ1_2: Q1.2(B1) R37.1
NetQ1_3: Q1.3(C1) R21.2 R24.2 R30.2
NetQ1_5: Q1.5(B2) R38.1
NetQ1_6: Q1.6(C2) R20.2 R23.2 R29.2
NetQ2_2: Q2.2(G1) Q4.3(C1) R26.1
NetQ2_4: Q2.4(G2) Q4.6(C2) R7.2 TP3.1(TP)
NetQ2_5: Q2.5(D2) R9.1 TP4.1(TP)
NetQ3_2: Q3.2(B1) R39.1
NetQ3_3: Q3.3(C1) R19.2 R22.2 R28.2
NetQ3_5: Q3.5(B2) R42.2
NetQ3_6: Q3.6(C2) R34.2
NetQ4_2: Q4.2(B1) R25.2
NetQ4_5: Q4.5(B2) R8.1
NetQ5_2: Q5.2(B1) R6.1
NetQ5_5: Q5.5(B2) R17.1
NetQ7_1: Q7.1(S1) R15.2 U3.9(SENSE)
NetQ7_2: Q7.2(G1) U3.7(DRV)
NetQ8_2: Q8.2(B1) R40.1
NetQ8_3: Q8.3(C1) R36.2
NetQ8_5: Q8.5(B2) R41.1
NetQ8_6: Q8.6(C2) R35.2
NetR13_1: R13.1 U3.2(NTC)
NetR14_1: R14.1 U3.6(PROG)
NetR28_1: R28.1 R_CH1.1
NetR34_1: R34.1 R_CH2.1
NetR43_1: R43.1 R44.2 SW2.2(COM)
NetR45_1: R45.1 R46.2 SW3.2(COM)

Not connected (* = marked no-connect by the designer): S1 1(PW) 2(GND); U3 10(~{ACPR})*

### Notes on the sheet
- Labels drawn without touching a wire or pin: (Debouncing button circuit), (Use in Quad-Link Mode 0,1,2,3), Atomizer Driver Circuit, Battery Charger, Battery Charger Level, Battery Status Interface, Button (BLE, Atom_PW), Cartridge Sense, Haptic Motor Driver Circuit, Into external LED, Magnetic Buzzer Driver Circuit, Motor+, Motor-, PWM1, PWM2, RGB LED Bank Channel 1, RGB LED Bank Channel 2
- Title
- Size:
- Date:
- A4
- Number:
- Time:
- Revision:
- Sheet
- of
- Drawn by:
- File:
- (in symbol LX0820) LX8020

### Library data of the parts
B_CH1 B_CH2 CH1_PW CH2_PW G_CH1 G_CH2 R_CH1 R_CH2 = TESTPAD_TH: Testpoint, through hole; Part Number: Testpoint TH; Artikkelnr Noca: N.A.; Manufacturer: *; Manufacturer Part Number: *; Datasheet: *; Footprint Doc: TESTPAD-TH; LatestRevisionDate: 2009-12-12; Pin Count: 1; Publisher: Nordic Semiconductor; Published: 2009-12-12; Value: TP; Note: *; Supplier: *; Supplier part number: *; 2nd source Supplier: *; 2nd source part number: *; Artikkelnr Simpro: N.A.
C25 = C0402-100n: as C4 on sheet Vapeix_mini_nrf; Part Number: C0402-100n; Manufacturer: *; Manufacturer Part Number: *; Datasheet: *; LatestRevisionDate: 2009-11-23; Pin Count: 2; Publisher: Nordic Semiconductor; Published: 2009-05-08; Value: 100nF; Supplier: *; Supplier part number: *; 2nd source Supplier: *; 2nd source part number: *; Footprint Doc: 0402
C26 C28 C29 = GRM219R61A106KE44D: CAP, CERM, 10 µF, 10 V, +/- 10%, X5R, 0805; Manufacturer: MuRata; Polarized: N; CompType: Capacitor; Value: 10uF; U/M: EA; Cap_F: 0.00001; Tolerance_%: 10; ESR_ohm: 0.005; Value1: 0.005 ohm; Value2: 10V; TaMin_C: -55; TaMax_C: 85; Cap_Case: 0805; SymbolVersion: 2008-07-09; PartNumber: GRM219R61A106KE44D; PackageReference: 0805; RoHS: Y; VDC_V: 10; MountType: SMT; Technology: Ceramic; TempCo: X5R; Published: 2008-06-19; Publisher: Texas Instruments; LatestRevisionDate: 2014-08-19; ComponentLink1Description: Datasheet link; ComponentLink1URL: http://psearch.murata.com/capacitor/product/GRM219R61A106KE44%23.pdf; Supplier 1: Digi-Key; Supplier Part Number 1: 490-4735-1-ND; Supplier 2: Mouser; Supplier Part Number 2: 81-GRM219R61A106KE4D; Supplier 3: Farnell; Supplier Part Number 3: 1845741
C27 = Cap Pol3: Polarized Capacitor (Surface Mount); Published: 8-Jun-2000; LatestRevisionDate: 29-May-2009; LatestRevisionNote: IPC-7351 Footprint Added.; PackageReference: C0805; Publisher: Altium Limited; PackageDescription: Chip Capacitor
D2-D5 = MSS2P2-M3/89A: as D1 on sheet Vapeix_mini_power; Supplier 1: Digi-Key; Manufacturer Part Number: MSS2P2-M3/89A; RoHS: RoHS Compliant; Category: Discrete Semiconductor Products; Stock 1: 3961; Pricing 1: 1=0.37, 10=0.274, 100=0.1552, 500=0.1029, 1000=0.07892 (USD); Packaging: Digi-Reel®; Diode Type: Schottky; Voltage - DC Reverse (Vr) (Max): 20V; Current - Average Rectified (Io): 2A; Reverse Recovery Time (trr): -; Mounting Type: Surface Mount; Package / Case: MicroSMP; Supplier Device Package: MicroSMP; Operating Temperature - Junction: -55°C ~ 150°C; ComponentLink1URL: http://www.vishay.com/docs/89054/mss2p3.pdf; ComponentLink1Description: http://www.vishay.com/docs/89054/mss2p3.pdf
LED1 LED2 = HSMF-C114: LED RGB DIFFUSED 0606 SMD; Manufacturer: Broadcom Limited; Color: Red, Green, Blue (RGB); Lens Color: White; Millicandela Rating: 85mcd Red, 180mcd Green, 70mcd Blue; Lens Style/Size: Rectangle with Flat Top, 1.10mm x 1.50mm; Voltage - Forward (Vf) (Typ): 1.9V Red, 3.4V Green, 3.4V Blue; Current - Test: 20mA Red, 20mA Green, 20mA Blue; Viewing Angle: 140° Red, 145° Green, 145° Blue; Wavelength - Dominant: 626nm Red, 525nm Green, 470nm Blue; Wavelength - Peak: 637nm Red, 523nm Green, 468nm Blue; Supplier 1: Digi-Key; Manufacturer Part Number: HSMF-C114; RoHS: RoHS Compliant; Category: Optoelectronics; Stock 1: 11787; Pricing 1: 1=2.03, 10=1.62, 25=1.2376, 100=1.125, 250=0.99, 500=0.8325, 1000=0.72 (USD); Packaging: Digi-Reel®; Lens Transparency: Diffused; Mounting Type: Surface Mount; Features: -; Package / Case: 0606 (1616 Metric); Supplier Device Package: Chip LED; Size / Dimension: 1.60mm L x 1.50mm W; Height (Max): 0.35mm; ComponentLink1URL: http://www.avagotech.com/docs/AV02-2451EN; ComponentLink1Description: http://www.avagotech.com/docs/AV02-2451EN
PAD1 PAD2 = Soldering_PAD: Soldering PAD
Q1 Q3-Q5 Q8 = BC847CDLP-7: TRANS 2NPN 45V 0.1A 6DFN; Manufacturer: Diodes Incorporated; Transistor Type: 2 NPN (Dual); Current - Collector (Ic) (Max): 100mA; Vce Saturation (Max) @ Ib, Ic: 600mV @ 5mA, 100mA; Current - Collector Cutoff (Max): 15nA; DC Current Gain (hFE) (Min) @ Ic, Vce: 420 @ 2mA, 5V; Power - Max: 350mW; Frequency - Transition: 100MHz; Supplier 1: Digi-Key; Manufacturer Part Number: BC847CDLP-7; RoHS: RoHS Compliant; Category: Discrete Semiconductor Products; Stock 1: 11845; Pricing 1: 1=0.36, 10=0.29, 100=0.198, 500=0.1482, 1000=0.111 (USD); Packaging: Cut Tape (CT); Voltage - Collector Emitter Breakdown (Max): 45V; Mounting Type: Surface Mount; Package / Case: 6-SMD, No Lead; Supplier Device Package: 6-DFN1310H4 (1.0x1.3); ComponentLink1URL: http://www.diodes.com/_files/datasheets/ds30817.pdf; ComponentLink1Description: http://www.diodes.com/_files/datasheets/ds30817.pdf
Q2 Q7 = SI5999EDU-T1-GE3: MOSFET 2P-CH 20V 6A POWERPAK; Manufacturer: Vishay Siliconix; FET Type: 2 P-Channel (Dual); FET Feature: Logic Level Gate; Rds On (Max) @ Id, Vgs: 59 mOhm @ 3.5A, 4.5V; Vgs(th) (Max) @ Id: 1.5V @ 250µA; Gate Charge (Qg) @ Vgs: 20nC @ 10V; Input Capacitance (Ciss) @ Vds: 496pF @ 10V; Power - Max: 10.4W; Supplier 1: Digi-Key; Manufacturer Part Number: SI5999EDU-T1-GE3; RoHS: RoHS Compliant; Category: Discrete Semiconductor Products; Stock 1: 2994; Pricing 1: 1=0.58, 10=0.51, 100=0.39, 500=0.309, 1000=0.2475 (USD); Packaging: Cut Tape (CT); Drain to Source Voltage (Vdss): 20V; Current - Continuous Drain (Id) @ 25°C: 6A; Operating Temperature: -55°C ~ 150°C (TJ); Mounting Type: Surface Mount; Package / Case: PowerPAK® ChipFET™ Dual; Supplier Device Package: PowerPAK® ChipFet Dual; ComponentLink1URL: http://www.vishay.com/docs/67019/si5999ed.pdf; ComponentLink1Description: http://www.vishay.com/docs/67019/si5999ed.pdf
R6-R12 R14 R15 R17 R19-R28 R34-R46 = R0402-10k: as R33 on sheet Vapeix_mini_nrf; Part Number: R0402-10k; Manufacturer: *; Manufacturer Part Number: *; Datasheet: *; LatestRevisionDate: 2009-11-23; Pin Count: 2; Publisher: Nordic Semiconductor; Published: 2009-05-08; Supplier: Farnell; Supplier part number: 173-8864; 2nd source Supplier: *; 2nd source part number: *; Footprint Doc: 0402
  R6 R17 R44 R46: Value: 470
  R7 R8 R25 R26: Value: 4.7K
  R9: Value: 4K
  R10 R43 R45: Value: 10K
  R11: Value: 402K
  R12: Value: 2K
  R14: Value: 19.6K
  R15: Value: 0.05
  R19 R22 R28 R34: Value: 464
  R20 R21 R23 R24 R35 R36: Value: 162
  R27: Value: 15K
  R37-R42: Value: 27K
R13 = RL0503-5820-97-MS: THERMISTOR MINI-SENS NTC 10K OHM; Manufacturer: Amphenol Advanced Sensors; Resistance Tolerance: ±1%; Supplier 1: Digi-Key; Manufacturer Part Number: RL0503-5820-97-MS; RoHS: RoHS Compliant; Category: Sensors, Transducers; Stock 1: 14949; Pricing 1: 1=2.39, 5=2.258, 10=1.935, 25=1.548, 50=1.419, 100=1.29, 250=1.19324, 500=1.12876, 1000=0.99975 (USD); Packaging: Bulk; Resistance in Ohms @ 25°C: 10k; B Value Tolerance: -; B0/50: -; B25/50: -; B25/75: -; B25/85: -; B25/100: -; Operating Temperature: -50°C ~ 150°C; Power - Max: -; Length - Lead Wire: -; Mounting Type: Free Hanging; Package / Case: Bead; ComponentLink1URL: http://www.amphenol-sensors.com/index.php?option=com_edocman&task=document.download&id=104; ComponentLink1Description: http://www.amphenol-sensors.com/index.php?option=com_edocman&task=document.download&id=104
R29 = R0402-10k: Resistor, ±1%, 0.063W; Value: 51; Note: Chip Res 1%; Artikkelnr Noca: 27049097; Artikkelnr Simpro: N.A.; Part Number: R0402-10k; Manufacturer: *; Manufacturer Part Number: *; Datasheet: *; LatestRevisionDate: 2009-11-23; Pin Count: 2; Publisher: Nordic Semiconductor; Published: 2009-05-08; Supplier: Farnell; Supplier part number: 173-8864; 2nd source Supplier: *; 2nd source part number: *; Footprint Doc: 0402
R30 = R0402-10k: Resistor, ±1%, 0.063W; Value: 300; Note: Chip Res 1%; Artikkelnr Noca: 27049097; Artikkelnr Simpro: N.A.; Part Number: R0402-10k; Manufacturer: *; Manufacturer Part Number: *; Datasheet: *; LatestRevisionDate: 2009-11-23; Pin Count: 2; Publisher: Nordic Semiconductor; Published: 2009-05-08; Supplier: Farnell; Supplier part number: 173-8864; 2nd source Supplier: *; 2nd source part number: *; Footprint Doc: 0402
S1 = LX0820: Coin Vibration Motor
SB5 SB6 = Solderbridge Shorted: as SB1 on sheet Vapeix_mini_nrf; Part Number: Solderbridge Shorted; Manufacturer: *; Manufacturer Part Number: *; Datasheet: *; LatestRevisionDate: 2012-08-07; Pin Count: 2; Publisher: Nordic Semiconductor; Published: 2012-08-07; Value: Solderbridge; Note: *; Supplier: *; Supplier part number: *; 2nd source Supplier: *; 2nd source part number: *; Footprint Doc: Solderbridge_Shorted; Artikkelnr Simpro: N.A.
SW2 SW3 = ALPS_SKHUALE010: ALPS - SKHUALE010 - Tactile Switch, SPNO, SMD, 6.5x6.2x2.5mm; 2nd source part number: 688-SKHUALE010; Value: RST SW; Artikkelnr Noca: 50019001; Artikkelnr Simpro: N.A.; Part Number: ALPS_SKHUALE010; Manufacturer: Alps; Manufacturer Part Number: SKHUALE010; Datasheet: https://www1.elfa.se/data1/wwwroot/webroot/Z_DATA/03579000.pdf; LatestRevisionDate: 2010-02-01; Pin Count: 4; Publisher: Nordic Semiconductor; Published: 2010-02-01; Note: *; Supplier: Elfa; Supplier part number: 35-790-00; 2nd source Supplier: Mouser; Footprint Doc: ALPS_SKHUxxx010_WO_GND
TP1-TP10 = TP: TEST POINT
U3 = LTC4050EMS-4.1#PBF: IC BATT CHRG CNTRL LI-ION 10MSOP; Manufacturer: Linear Technology; Function: Charge Management; Voltage - Supply: 4.5 V ~ 10 V; Supplier 1: Digi-Key; Manufacturer Part Number: LTC4050EMS-4.1#PBF; RoHS: RoHS Compliant; Category: Integrated Circuits (ICs); Stock 1: 1327; Pricing 1: 1=4.77, 25=3.1696, 100=2.3869 (USD); Packaging: Tube; Battery Chemistry: Li-Ion; Operating Temperature: -40°C ~ 85°C; Mounting Type: Surface Mount; Package / Case: 10-TFSOP, 10-MSOP (0.118", 3.00mm Width); Supplier Device Package: 10-MSOP; ComponentLink1URL: http://www.linear.com/docs/3321; ComponentLink1Description: http://www.linear.com/docs/3321

## Nets that join several sheets
BAT+: Vapeix_mini_power (C1.2 P21.2 P22.2 U2.1), Vapeix_mini_Shield (16 pins)
GND: Vapeix_mini_nrf (23 pins), Vapeix_mini_power (11 pins), Vapeix_mini_Shield (22 pins)
VBUS: Vapeix_mini_power (C20.2 C21.2 J2.1 TP14.1), Vapeix_mini_Shield (D5.1)
VDD_nRF: Vapeix_mini_nrf (8 pins), Vapeix_mini_power (D1.2 TP13.1), Vapeix_mini_Shield (R11.1)
ATM+: Vapeix_mini_power (CON1.2), Vapeix_mini_Shield (D2.2 Q2.7 TP6.1)
ATM_EN: Vapeix_mini_nrf (U1.6), Vapeix_mini_Shield (R25.1 TP5.1)
Atom_SW: Vapeix_mini_nrf (U1.29), Vapeix_mini_Shield (C28.1 R44.1)
B_CH1: Vapeix_mini_nrf (U1.15), Vapeix_mini_Shield (R37.2 TP8.1)
B_CH2: Vapeix_mini_nrf (U1.8), Vapeix_mini_Shield (R40.2)
BAT_SENSE: Vapeix_mini_nrf (U1.5), Vapeix_mini_Shield (R9.2 R10.1 TP2.1)
BAT_SENSE_EN: Vapeix_mini_nrf (U1.7), Vapeix_mini_Shield (R8.2 TP1.1)
BLE_SW: Vapeix_mini_nrf (U1.18), Vapeix_mini_Shield (C29.1 R46.1)
BuzzerEN: Vapeix_mini_nrf (U1.21), Vapeix_mini_Shield (R17.2)
Cartridge_EN: Vapeix_mini_nrf (U1.42), Vapeix_mini_Shield (R27.2)
G_CH1: Vapeix_mini_nrf (U1.16), Vapeix_mini_Shield (R38.2 TP9.1)
G_CH2: Vapeix_mini_nrf (U1.9), Vapeix_mini_Shield (R41.2)
~{M_CHRG}: Vapeix_mini_nrf (U1.19), Vapeix_mini_Shield (R11.2 R12.2 TP7.1 U3.3)
MotorEN: Vapeix_mini_nrf (U1.22), Vapeix_mini_Shield (R6.2)
P1_5: Vapeix_mini_nrf (U1.20), Vapeix_mini_Shield (R12.1)
R_CH1: Vapeix_mini_nrf (U1.17), Vapeix_mini_Shield (R39.2 TP10.1)
R_CH2: Vapeix_mini_nrf (U1.10), Vapeix_mini_Shield (R42.1)
SCL: Vapeix_mini_nrf (R33.1 U1.38), Vapeix_mini_power (CON1.4)
SDA: Vapeix_mini_nrf (U1.39), Vapeix_mini_power (CON1.3), Vapeix_mini_Shield (R27.1)